# EAGLE design IRQF103C8revC (EAGLE 9.0.0)
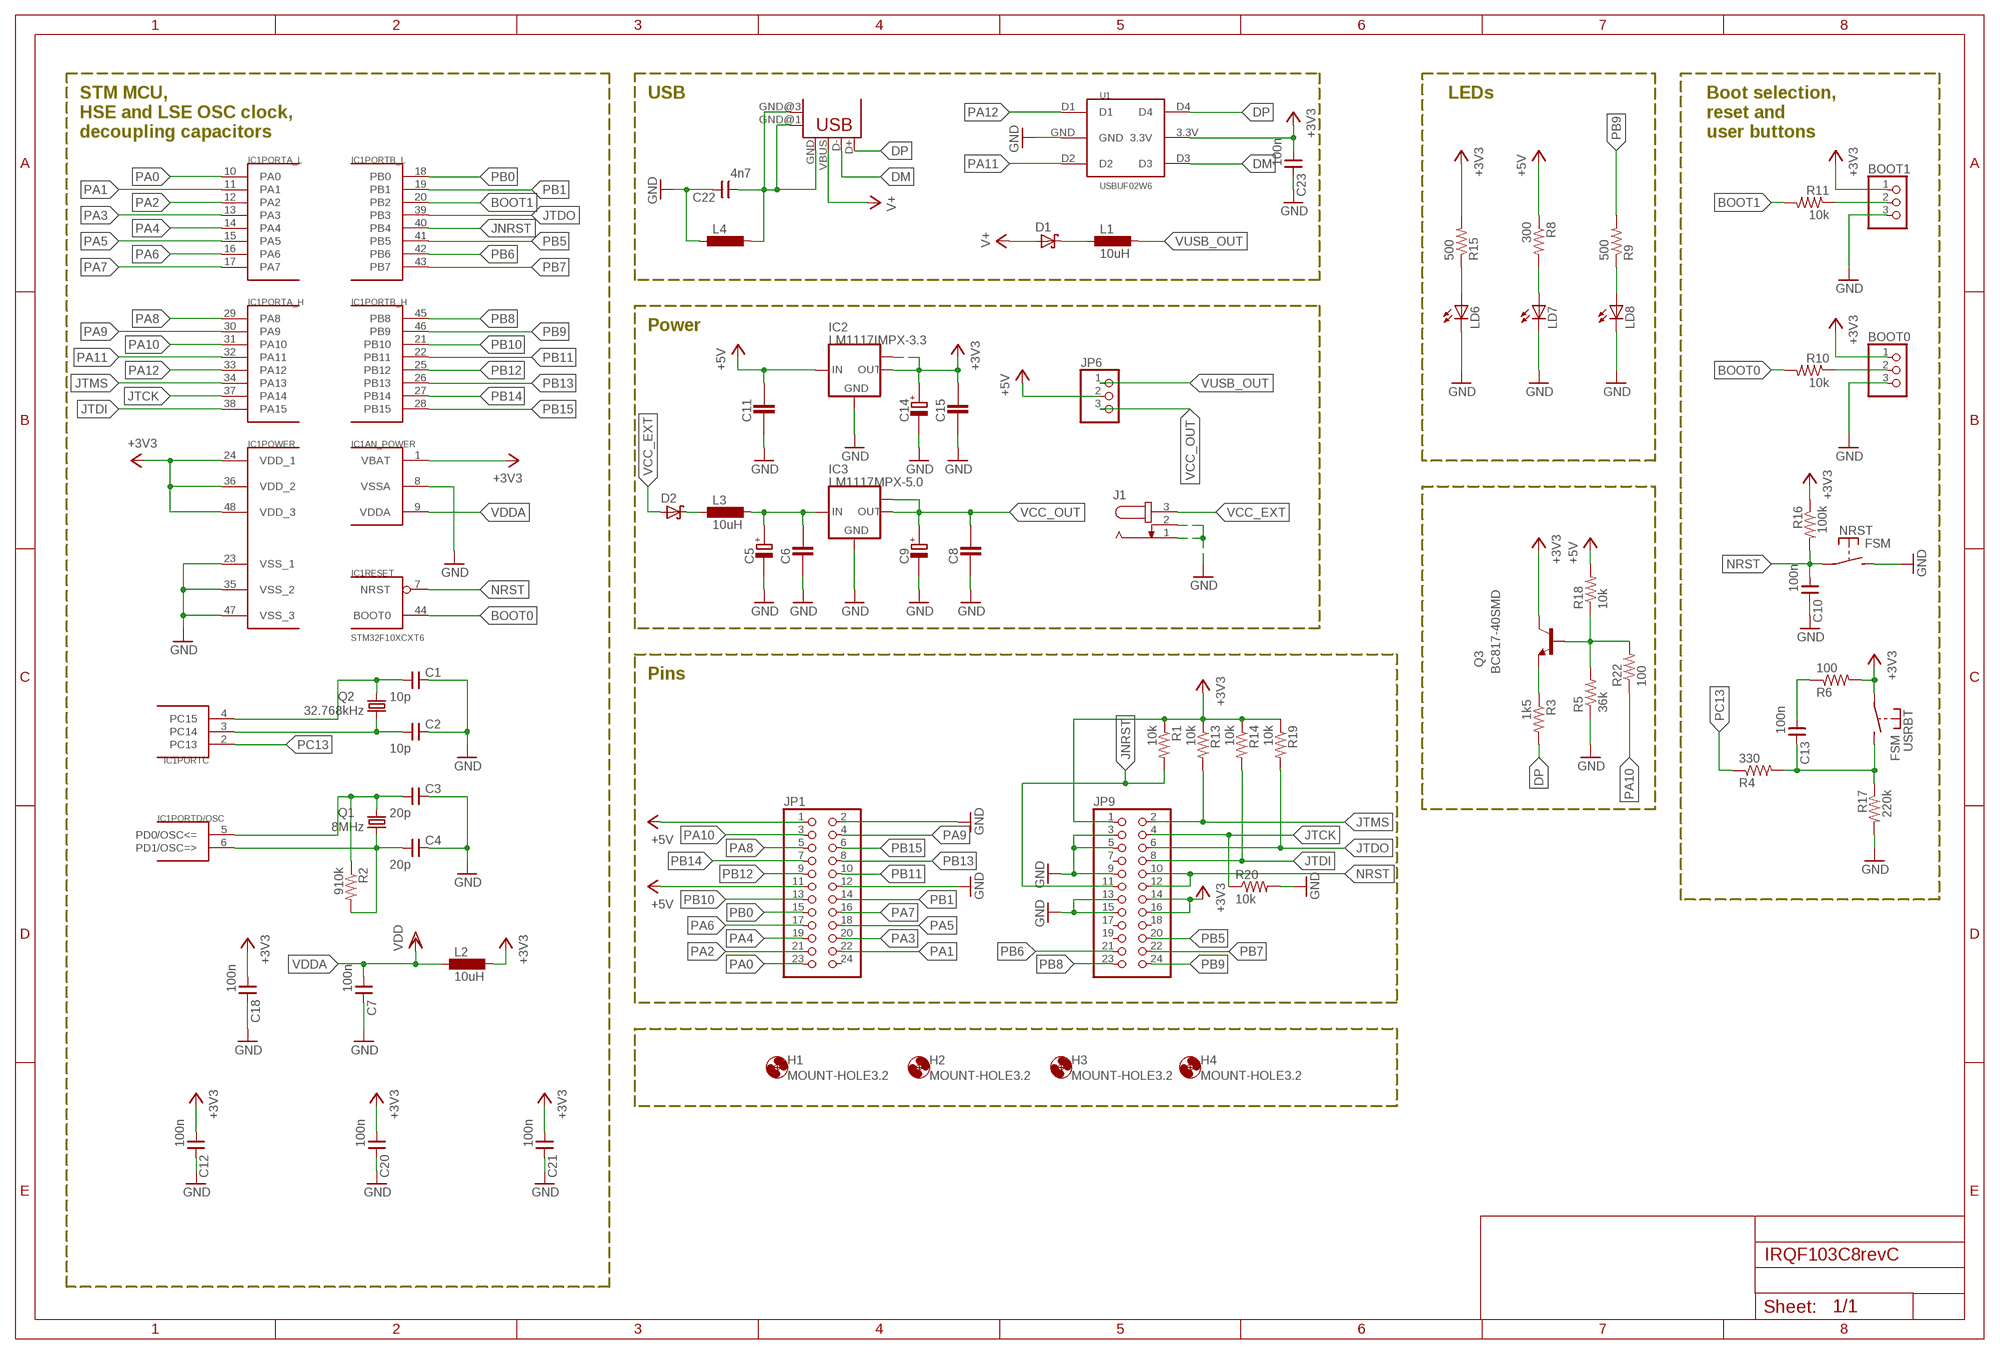
[diagram p0: schematic, sheet 1]

## Parts
BOOT0  PINHD-1X3  [1X03]
BOOT1  PINHD-1X3  [1X03]
C1  10p  CNP-0805  [0805]
C2  10p  CNP-0805  [0805]
C3  20p  CNP-0805  [0805]
C4  20p  CNP-0805  [0805]
C5  POLARISED_CASE_B  [CAPAE430X540N]
C6  CAPACITOR_0805  [CAPC2012X145AN]
C7  100n  CNP-0805  [0805]
C8  CAPACITOR_0805  [CAPC2012X145AN]
C9  POLARISED_CASE_D  [CAPAE660X540N]
C10  100n  CNP-0805  [0805]
C11  CAPACITOR_1206  [CAPC3215X168N]
C12  100n  CNP-0805  [0805]
C13  100n  CNP-0805  [0805]
C14  POLARISED_CASE_C  [CAPAE530X540N]
C15  CAPACITOR_0805  [CAPC2012X145AN]
C18  100n  CNP-0805  [0805]
C20  100n  CNP-0805  [0805]
C21  100n  CNP-0805  [0805]
C22  4n7  CNP-0805  [0805]
C23  100n  CNP-0805  [0805]
D1  SCHOTTKY_SMA  [DIOM5326X292N]
D2  SCHOTTKY_SMA  [DIOM5326X292N]
H1  MOUNT-HOLE3.2  [3,2]
H2  MOUNT-HOLE3.2  [3,2]
H3  MOUNT-HOLE3.2  [3,2]
H4  MOUNT-HOLE3.2  [3,2]
IC1  STM32F10XCXT6  [TQFP48]
IC2  LM1117IMPX-3.3  [SOT223]
IC3  LM1117MPX-5.0  [SOT223]
J1  JACK-PLUG1  [SPC4078]
JP1  PINHD-2X12  [2X12]
JP6  PINHD-1X3  [1X03]
JP9  PINHD-2X12  [2X12]
L1  10uH  INDUCTOR_0603  [INDC1608X95N]
L2  10uH  INDUCTOR_0603  [INDC1608X95N]
L3  10uH  INDUCTOR_0603  [INDC1608X95N]
L4  INDUCTOR_0603  [INDC1608X95N]
LD6  LEDCHIPLED_0805  [CHIPLED_0805]
LD7  LEDCHIPLED_0805  [CHIPLED_0805]
LD8  LEDCHIPLED_0805  [CHIPLED_0805]
NRST  FSM  [FSM]
Q1  8MHz  CRYTALHC49S  [HC49/S]
Q2  32.768kHz  CRYTALTC26H  [TC26H]
Q3  BC817-40SMD  [SOT23-BEC]
R1  10k  R-US_M0805  [M0805]
R2  910k  R-US_M0805  [M0805]
R3  1k5  R-US_M0805  [M0805]
R4  330  R-US_M0805  [M0805]
R5  36k  R-US_M0805  [M0805]
R6  100  R-US_M0805  [M0805]
R8  300  R-US_M0805  [M0805]
R9  500  R-US_M0805  [M0805]
R10  10k  R-US_M0805  [M0805]
R11  10k  R-US_M0805  [M0805]
R13  10k  R-US_M0805  [M0805]
R14  10k  R-US_M0805  [M0805]
R15  500  R-US_M0805  [M0805]
R16  100k  R-US_M0805  [M0805]
R17  220k  R-US_M0805  [M0805]
R18  10k  R-US_M0805  [M0805]
R19  10k  R-US_M0805  [M0805]
R20  10k  R-US_M0805  [M0805]
R22  100  R-US_M0805  [M0805]
U1  USBUF02W6  [SOT23-6L]
USB1  USB-MB-S  [USB-MB-S]
USRBT  FSM  [FSM]

## Nets
+3V3: BOOT0.1 BOOT1.1 C12.1 C14.+ C15.2 C18.1 C20.1 C21.1 C23.1 IC1.1(AN_POWER:VBAT) IC1.24(POWER:VDD_1) IC1.36(POWER:VDD_2) IC1.48(POWER:VDD_3) IC2.2(OUT) IC2.TAB(OUT1) JP9.1 JP9.14 JP9.16 L2.2 Q3.C R1.1 R6.2 R13.1 R14.1 R15.2 R16.1 R19.1 U1.3.3V USRBT.P$1(P)
+5V: C11.2 IC2.3(IN) JP1.1 JP1.11 JP6.2 R8.1 R18.2
BOOT0: IC1.44(RESET:BOOT0) R10.2
BOOT1: IC1.20(PORTB_L:PB2) R11.2
DM: U1.D3 USB1.D-
DP: R3.2 U1.D4 USB1.D+
GND: BOOT0.3 BOOT1.3 C1.2 C2.2 C3.2 C4.2 C5.- C6.1 C7.2 C8.1 C9.- C10.2 C11.1 C12.2 C14.- C15.1 C18.2 C20.2 C21.2 C22.2 C23.2 IC1.8(AN_POWER:VSSA) IC1.23(POWER:VSS_1) IC1.35(POWER:VSS_2) IC1.47(POWER:VSS_3) IC2.1(GND) IC3.1(GND) J1.1 J1.2 JP1.2 JP1.12 JP9.3 JP9.5 JP9.9 JP9.13 JP9.15 L4.1 LD6.C LD7.C LD8.C NRST.P$2(S) R5.1 R17.2 R20.2 U1.GND
JNRST: IC1.40(PORTB_L:PB4) JP9.11 R1.2
JTCK: IC1.37(PORTA_H:PA14) JP9.4 R20.1
JTDI: IC1.38(PORTA_H:PA15) JP9.8 R14.2
JTDO: IC1.39(PORTB_L:PB3) JP9.6 R19.2
JTMS: IC1.34(PORTA_H:PA13) JP9.2 R13.2
N$1: C2.1 IC1.3(PORTC:PC14) Q2.1
N$2: C1.1 IC1.4(PORTC:PC15) Q2.2
N$3: C4.1 IC1.6(PORTD/OSC:PD1/OSC=>) Q1.1 R2.2
N$4: C3.1 IC1.5(PORTD/OSC:PD0/OSC<=) Q1.2 R2.1
N$5: BOOT0.2 R10.1
N$6: LD7.A R8.2
N$7: D2.K L3.1
N$8: D1.K L1.1
N$9: Q3.B R5.2 R18.1 R22.2
N$10: C5.+ C6.2 IC3.3(IN) L3.2
N$11: Q3.E R3.1
N$12: C13.2 R4.2 R17.1 USRBT.P$2(S)
N$13: C13.1 R6.1
N$15: LD8.A R9.1
N$16: C22.1 L4.2 USB1.GND USB1.GND@1(GND) USB1.GND@3(GND)
N$19: LD6.A R15.1
NRST: C10.1 IC1.7(RESET:NRST) JP9.10 JP9.12 NRST.P$1(P) R16.2
PA0: IC1.10(PORTA_L:PA0) JP1.23
PA1: IC1.11(PORTA_L:PA1) JP1.22
PA2: IC1.12(PORTA_L:PA2) JP1.21
PA3: IC1.13(PORTA_L:PA3) JP1.20
PA4: IC1.14(PORTA_L:PA4) JP1.19
PA5: IC1.15(PORTA_L:PA5) JP1.18
PA6: IC1.16(PORTA_L:PA6) JP1.17
PA7: IC1.17(PORTA_L:PA7) JP1.16
PA8: IC1.29(PORTA_H:PA8) JP1.5
PA9: IC1.30(PORTA_H:PA9) JP1.4
PA10: IC1.31(PORTA_H:PA10) JP1.3 R22.1
PA11: IC1.32(PORTA_H:PA11) U1.D2
PA12: IC1.33(PORTA_H:PA12) U1.D1
PB0: IC1.18(PORTB_L:PB0) JP1.15
PB1: IC1.19(PORTB_L:PB1) JP1.14
PB2: BOOT1.2 R11.1
PB5: IC1.41(PORTB_L:PB5) JP9.20
PB6: IC1.42(PORTB_L:PB6) JP9.21
PB7: IC1.43(PORTB_L:PB7) JP9.22
PB8: IC1.45(PORTB_H:PB8) JP9.23
PB9: IC1.46(PORTB_H:PB9) JP9.24 R9.2
PB10: IC1.21(PORTB_H:PB10) JP1.13
PB11: IC1.22(PORTB_H:PB11) JP1.10
PB12: IC1.25(PORTB_H:PB12) JP1.9
PB13: IC1.26(PORTB_H:PB13) JP1.8
PB14: IC1.27(PORTB_H:PB14) JP1.7
PB15: IC1.28(PORTB_H:PB15) JP1.6
PC13: IC1.2(PORTC:PC13) R4.1
V+: D1.A USB1.VBUS
VCC_EXT: D2.A J1.3
VCC_OUT: C8.2 C9.+ IC3.2(OUT) IC3.TAB(OUT1) JP6.3
VDDA: C7.1 IC1.9(AN_POWER:VDDA) L2.1 ; supply symbol labelled VDD
VUSB_OUT: JP6.1 L1.2
Unconnected: JP1.24 JP9.7 JP9.17 JP9.18 JP9.19

## Notes on the sheet
- USB | LEDs
- STM MCU, 
  HSE and LSE OSC clock,
  decoupling capacitors
- Boot selection,
  reset and
  user buttons
- Power
- Pins

## Library data of the parts
BOOT0 BOOT1 JP6 = pinhead:PINHD-1X3: PIN HEADER
C1-C4 C7 C10 C12 C13 C18 C20-C23 = cap-master:CNP-: NON-POLARIZED CAP
C5 C9 C14 = ipc-7351-capacitor:POLARISED_
C6 C8 C11 C15 = ipc-7351-capacitor:CAPACITOR_
D1 D2 = ipc-7351-diode:SCHOTTKY_
H1-H4 = holes:MOUNT-HOLE: MOUNTING HOLE with drill center marker
IC1 = stm32:STM32F10XCXT6: ST STM32F101/103 48pin LQFP
IC2 = lm1117:LM1117IMPX-*
IC3 = lm1117:LM1117MPX-*
J1 = con-jack:JACK-PLUG: DC POWER JACK Power Jack, DC, Right Angle, Through Hole, Rated 5A at 16VDC, PC Terminals Distributor: Farnell (www.Farnell.de) Drawing: 84N1161.pdf / 84N1162.pdf Manufacturer: SPC Technology (www.spctechnology.com) Type: SPC4077 / SPC 4078
JP1 JP9 = pinhead:PINHD-2X12: PIN HEADER
L1-L4 = ipc-7351-inductor:INDUCTOR_
LD6-LD8 = led:LED: LED OSRAM: - CHIPLED LG R971, LG N971, LY N971, LG Q971, LY Q971, LO R971, LY R971 LH N974, LH R974 LS Q976, LO Q976, LY Q976 LO Q996 - Hyper CHIPLED LW Q18S LB Q993, LB Q99A, LB R99A - SideLED LS A670, LO A670, LY A670, LG A670, LP A670 LB A673, LV A673, LT A673, LW A673 LH A674 LY A675 LS A676, LA A676, LO A676, LY A676, LW A676 LS A679, LY A679, LG A679 - Hyper Micro SIDELED® LS Y876, LA Y876, LO Y876, LY Y876 LT Y87S - SmartLED LW L88C, LW L88S LB L89C, LB L89S, LG L890 LS L89K, LO L89K, LY L89K LS L896, LA L896, LO L896, LY L896 - TOPLED LS T670, LO T670, LY T670, LG T670, LP T670 LSG T670, LSP T670, LSY T670, LOP T670, LYG T670 LG T671, LOG T671, LSG T671 LB T673, LV T673, LT T673, LW T673 LH T674 LS T676, LA T676, LO T676, LY T676, LB T676, LH T676, LSB T676, LW T676 LB T67C, LV T67C, LT T67C, LS T67K, LO T67K, LY T67K, LW E67C LS E67B, LA E67B, LO E67B, LY E67B, LB E67C, LV E67C, LT E67C LW T67C LS T679, LY T679, LG T679 LS T770, LO T770, LY T770, LG T770, LP T770 LB T773, LV T773, LT T773, LW T773 LH T774 LS E675, LA E675, LY E675, LS T675 LS T776, LA T776, LO T776, LY T776, LB T776 LHGB T686 LT T68C, LB T68C - Hyper Mini TOPLED® LB M676 - Mini TOPLED Santana® LG M470 LS M47K, LO M47K, LY M47K Source: http://www.osram.convergy.de/
NRST USRBT = switch-misc:FSM: TYCO SWITCH
Q1 Q2 = crystal:CRYTAL: CRYSTAL
Q3 = transistor-npn:BC817*: NPN Transistor
R1-R6 R8-R11 R13-R20 R22 = resistor:R-US_: RESISTOR, American symbol
U1 = USBUF:USBUF02W6: EMI filter and line termination for USB upstream ports
USB1 = con-usb-2:USB: USB Connectors

## Board
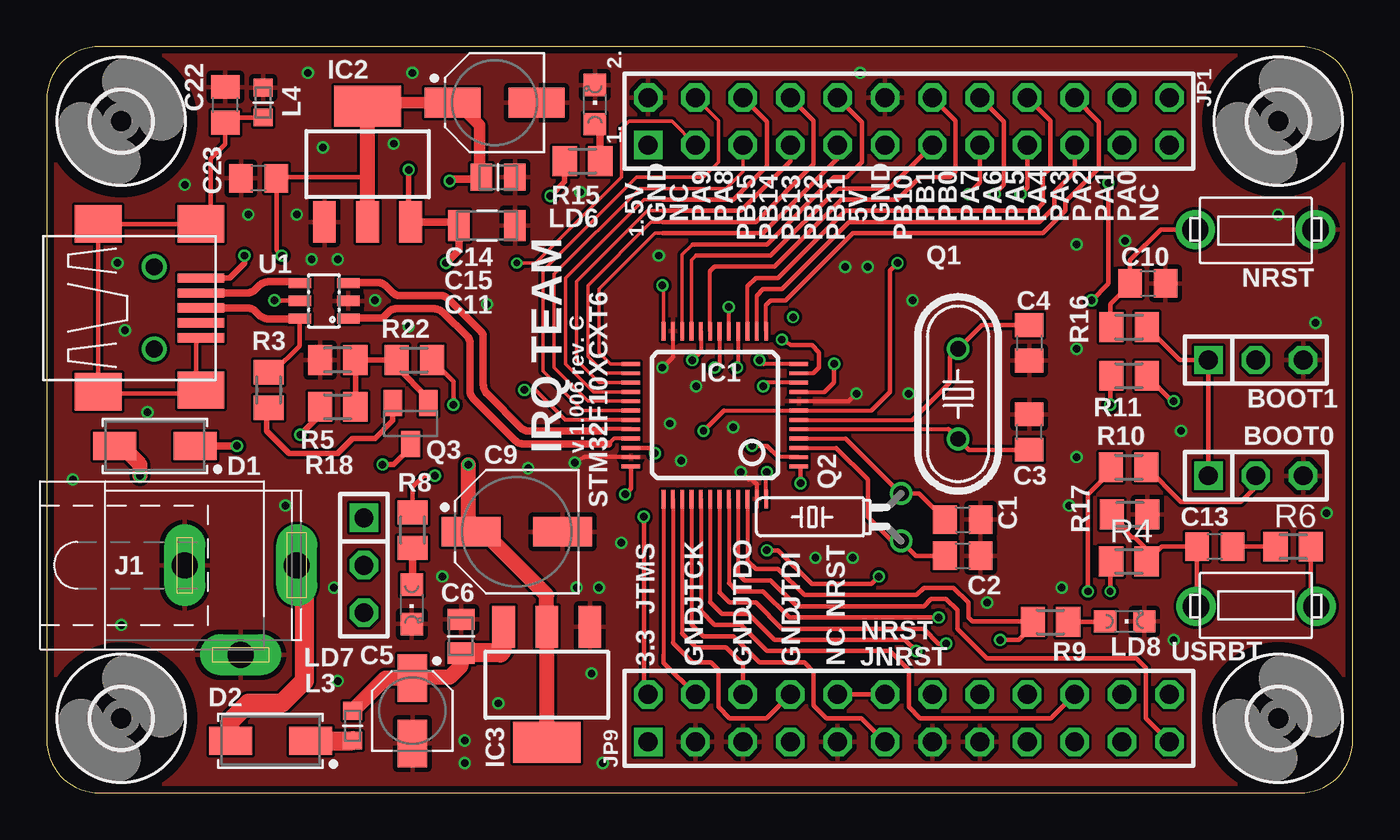
[diagram p1: board, top side]
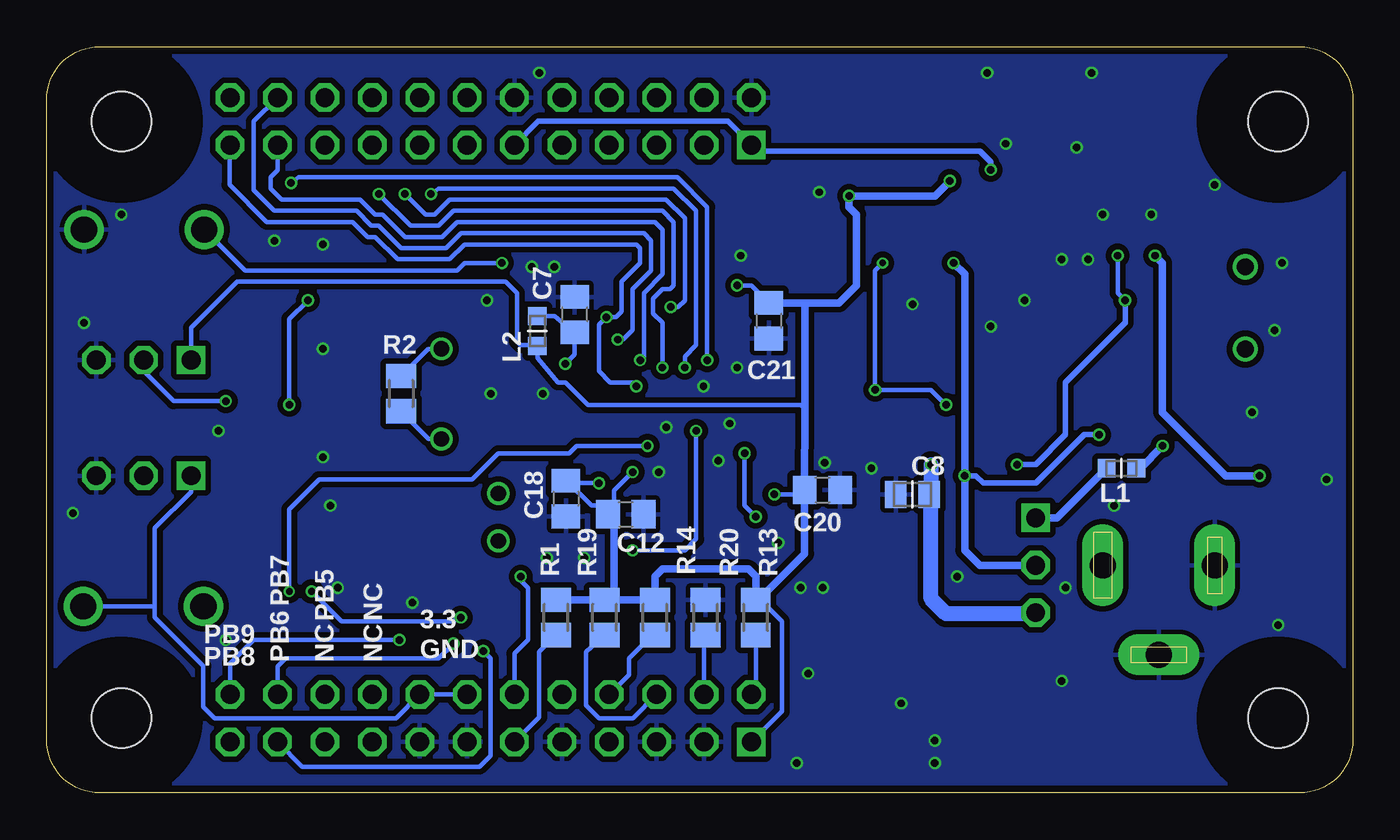
[diagram p2: board, bottom side, seen from below]

Size 70 x 40 mm. Coordinates in mm from the lower left corner, seen from the top.
Outline: 0,37.17 0,2.83 arc90 2.83,0 67.17,0 arc90 70,2.83 70,37.17 arc90 67.17,40 2.83,40 arc90 0,37.17
Copper layers (1*16): Top 0.035559375mm / dielectric 1.6mm / Bottom 0.035559375mm
Design rules "oshpark-2layer": minimum track width 6mil, minimum drill 10mil, track to track 6mil, track to pad 6mil, pad to pad 6mil, via to via 6mil, smd to smd 6mil, copper to edge 15mil, drill to drill 6mil, minimum pad ring 5mil, minimum via ring 5mil, stop-mask expansion 2.5mil, vias tented up to drill 0mil, thermal gap 10mil

### Footprints (pad centres in the part's own frame; a part is rotated, then mirrored left to right if it is on the bottom)
1X03 = drill 1.016 square: 1 -2.54,0 | drill 1.016 octagon: 2 0,0; 3 2.54,0
0805 = smd 1.27 x 1.524: 1 -0.953,0; 2 0.953,0
CAPAE430X540N = smd 2.55 x 1.6: + -1.75,0; - 1.75,0
CAPC2012X145AN = smd 1.15 x 1.45: 1 -0.9,0; 2 0.9,0
CAPAE660X540N = smd 3.15 x 1.6: + -2.45,0; - 2.45,0
CAPC3215X168N = smd 1.15 x 1.65: 1 -1.5,0; 2 1.5,0
CAPAE530X540N = smd 3 x 1.6: + -2.25,0; - 2.25,0
DIOM5326X292N = smd 2.3 x 1.5: A 2.15,0; K -2.15,0
3,2 = hole 3.2: 0,0
TQFP48 = smd 0.2 x 1: 1 -2.75,-4.5; 2 -2.25,-4.5; 3 -1.75,-4.5; 4 -1.25,-4.5; 5 -0.75,-4.5; 6 -0.25,-4.5; 7 0.25,-4.5; 8 0.75,-4.5; 9 1.25,-4.5; 10 1.75,-4.5; 11 2.25,-4.5; 12 2.75,-4.5; 25 2.75,4.5; 26 2.25,4.5; 27 1.75,4.5; 28 1.25,4.5; 29 0.75,4.5; 30 0.25,4.5; 31 -0.25,4.5; 32 -0.75,4.5; 33 -1.25,4.5; 34 -1.75,4.5; 35 -2.25,4.5; 36 -2.75,4.5 | smd 1 x 0.2: 13 4.5,-2.75; 14 4.5,-2.25; 15 4.5,-1.75; 16 4.5,-1.25; 17 4.5,-0.75; 18 4.5,-0.25; 19 4.5,0.25; 20 4.5,0.75; 21 4.5,1.25; 22 4.5,1.75; 23 4.5,2.25; 24 4.5,2.75; 37 -4.5,2.75; 38 -4.5,2.25; 39 -4.5,1.75; 40 -4.5,1.25; 41 -4.5,0.75; 42 -4.5,0.25; 43 -4.5,-0.25; 44 -4.5,-0.75; 45 -4.5,-1.25; 46 -4.5,-1.75; 47 -4.5,-2.25; 48 -4.5,-2.75
SOT223 = smd 1.219 x 2.235: 1 -2.311,-3.099; 2 0,-3.099; 3 2.311,-3.099 | smd 3.6 x 2.2: TAB 0,3.099
SPC4078 = drill 1.4 pad 2.184 long: 1 -3,0; 2 0,-4.8; 3 3,0
2X12 = drill 1.016 square: 1 -13.97,-1.27 | drill 1.016 octagon: 2 -13.97,1.27; 3 -11.43,-1.27; 4 -11.43,1.27; 5 -8.89,-1.27; 6 -8.89,1.27; 7 -6.35,-1.27; 8 -6.35,1.27; 9 -3.81,-1.27; 10 -3.81,1.27; 11 -1.27,-1.27; 12 -1.27,1.27; 13 1.27,-1.27; 14 1.27,1.27; 15 3.81,-1.27; 16 3.81,1.27; 17 6.35,-1.27; 18 6.35,1.27; 19 8.89,-1.27; 20 8.89,1.27; 21 11.43,-1.27; 22 11.43,1.27; 23 13.97,-1.27; 24 13.97,1.27
INDC1608X95N = smd 0.95 x 1: 1 -0.8,0; 2 0.8,0
CHIPLED_0805 = smd 1.2 x 1.2: A 0,-1.05; C 0,1.05
FSM = drill 1.397: P$1 0,3.25; P$2 0,-3.2
HC49/S = drill 0.813: 1 -2.413,0; 2 2.413,0
TC26H = drill 0.813: 1 -1.27,0; 2 1.27,0
SOT23-BEC = smd 1 x 1.4: B -0.95,-1.1; C 0,1.1; E 0.95,-1.1
M0805 = smd 1.3 x 1.6: 1 -0.95,0; 2 0.95,0
SOT23-6L = smd 0.55 x 1.2: 3.3V 0,1.3; D1 -0.95,-1.3; D2 0.95,-1.3; D3 0.95,1.3; D4 -0.95,1.3; GND 0,-1.3
USB-MB-S = smd 2.5 x 0.5: D+ 2.5,0; D- 2.5,0.8; GND 2.5,-1.6; ID 2.5,-0.8; VBUS 2.5,1.6 | smd 2.5 x 2: GND@1 -3,4.5; GND@2 2.5,4.5; GND@3 -3,-4.5; GND@4 2.5,-4.4 | drill 0.9: P$5 0,2.2; P$6 0,-2.2

### Placement (x,y rotation side)
BOOT0  64.8,17 0 top
BOOT1  64.8,23.2 0 top
C1  49.1,14.65 0 top
C2  49.1,12.71 0 top
C3  52.66,19.34 90 top
C4  52.66,24.13 270 top
C5  19.6,4.4 270 top
C6  22.2,8.4 270 top
C7  41.7,25.63 90 bottom
C8  23.6,16 0 bottom
C9  25.2,14 0 top
C10  59.01,27.31 0 top
C11  23.6,30.4 180 top
C12  38.97,14.93 0 bottom
C13  62.6,13.2 180 top
C14  24,37 0 top
C15  24.2,33 180 top
C18  42.17,15.77 270 bottom
C20  28.43,16.24 0 bottom
C21  31.29,25.31 270 bottom
C22  9.57,36.88 90 top
C23  11.37,32.94 180 top
D1  5.8,18.6 180 top
D2  12,2.8 180 top
H1  66,36 0 top
H2  4,36 0 top
H3  4,4 0 top
H4  66,4 0 top
IC1  35.81,20.24 90 top
IC2  17.2,33.7 0 top
IC3  26.8,5.8 180 top
J1  10.4,12.2 0 top
JP1  46.2,36 0 top
JP6  17,12.2 270 top
JP9  46.2,4 0 top
L1  12.4,17.4 180 bottom
L2  43.7,24.75 270 bottom
L3  16.4,3.6 90 top
L4  11.6,37 270 top
LD6  29.38,36.9 0 top
LD7  19.56,10.1 180 top
LD8  57.77,9.19 270 top
NRST  64.8,30.2 90 top
Q1  48.85,21.39 270 top
Q2  45.79,14.78 90 top
Q3  19.5,19.8 180 top
R1  42.7,9.4 270 bottom
R2  51,21.4 90 bottom
R3  11.9,21.6 90 top
R4  58,12.4 0 top
R5  15.6,23.2 0 top
R6  66.8,13.2 0 top
R8  19.61,14.08 270 top
R9  53.8,9.16 180 top
R10  57.99,17.46 180 top
R11  58,22.36 180 top
R13  32,9.4 270 bottom
R14  37.4,9.4 270 bottom
R15  28.72,33.86 180 top
R16  58.01,24.97 180 top
R17  58.04,14.92 0 top
R18  15.6,20.7 180 top
R19  40.1,9.4 270 bottom
R20  34.7,9.4 90 bottom
R22  19.7,23.2 180 top
U1  14.86,26.37 90 top
USB1  5.76,25.99 0 top
USRBT  64.8,10 270 top

### Tracks (layer width: path | path; a pad name or v marks a point on that pad's centre or on a via)
+3V3  (via drill 0.4, 0.4 pad 0.25)
  Top 0.2: IC1.24 33.06,27.14
  Top 0.203: IC1.48 38.56,17.16 | IC1.1 40.4,17.49
  Top 0.254: U1.3.3V 13.53,26.4 v12.2,26.4 | v12.6,28.8 12.32,29.08 C23.1 12.37,33 17.2,33 | 33.06,27.14 v33,27.2 | R16.1 60.72,23.2 BOOT1.1 BOOT0.1 | IC1.36 31.31,16.31 v31,16 | 38.56,17.16 v38.6,17.2 | 40.4,17.49 v40.4,16.6 | R6.2 67.75,10.3 USRBT.P$1
  Top 0.305: v18,17.6 18.6,17.6 19.5,18.5 Q3.C | R15.2 27.77,32.77 v27,32
  Top 0.406: 23.2,32.9 21.7,32.9 v21.6,32.8
  Top 0.61: 17.6,36.6 18,37 C14.+ 22,37 23.2,35.8 23.2,33.1 C15.2 23.2,32.9
  Top 0.813: 17.2,36.2 17.2,33 IC2.2 | 17.2,36.2 IC2.TAB | 17.2,36.2 17.6,36.6
  Bottom 0.254: v12.2,26.4 12.6,26.8 v12.6,28.8 | v33,27.2 32.23,27.2 C21.1 | R13.1 31.65,10 31.4,10 30.6,9.2 30.6,4.36 JP9.1 | v31,16 29.54,16 C20.1 | v38.6,17.2 39.6,16.2 39.6,15.4 | 39.6,14.61 39.6,15.4 | 39.6,15.4 39.8,15.6 arc28 40.6,15.4 40.8,15.4 42.13,16.73 C18.1 42.17,16.6 v40.4,16.6 | 29.37,21.6 | 29.37,20.6 29.57,20.8 41,20.8 42.2,22 42.6,22 43.7,23.3 L2.2 43.95,24 44.6,24 44.8,24.2 44.8,26.8 45.4,27.4 59.8,27.4 62.26,24.94 BOOT1.1 | JP9.14 JP9.16 51.28,4 61,4 61.6,4.6 61.6,6.8 64.2,9.4 64.2,10 | 64.2,10 64.2,14.2 62.26,16.14 BOOT0.1 | USRBT.P$1 64.2,10
  Bottom 0.305: v12.2,26.4 12.2,25.2 15.4,22 15.4,19.2 17,17.6 v18,17.6
  Bottom 0.406: 29.4,26.26 C21.1 | 29.4,26.26 29.36,26.22 29.37,21.6 29.37,20.6 C20.1 29.38,12.82 31.85,10.35 R13.1 32,11.6 32.4,12 37,12 37.4,11.6 R14.1 39.6,10.35 | 39.6,10.35 R19.1 R1.1 | C12.1 39.6,14.61 39.6,10.35 | 29.4,26.26 27.54,26.26 26.6,27.2 26.6,31 27,31.4 v27,32 22.4,32 v21.6,32.8
+5V  (via drill 0.4)
  Top 0.254: R8.1 19.61,16.41 20.2,17 v20.8,17
  Top 0.305: v19.4,33.4 19.4,31.2 19.51,31.09 IC2.3 | 14.65,20.65 R18.2 14.65,20.25 v13.6,19.2
  Top 0.406: v21.4,28.4 22.1,29.1 C11.2 21.9,30.6 IC2.3
  Bottom 0.305: v19.4,33.4 19.4,33.8 20,34.4 31.9,34.4 JP1.1 33.5,36 43.66,36 JP1.11 | v13.6,19.2 14.4,19.2 17,16.6 19.8,16.6 20.2,17 v20.8,17
  Bottom 0.406: v21.4,28.4 20.8,27.8 v20.8,17 20.8,13 20,12.2 JP6.2
BOOT0  (via drill 0.4, 0.4 pad 0.25)
  Top 0.203: IC1.44 36.56,11.24
  Top 0.254: 36.56,11.24 37,10.8 38.4,10.8 39.8,9.4 v47.8,9.4 | R10.2 57.04,17.24 55.8,16 v55.8,10.8
  Bottom 0.254: v47.8,9.4 48,9.4 48.2,9.2 54.2,9.2 v55.8,10.8
BOOT1  (via drill 0.4)
  Top 0.203: IC1.20 35.06,23.66
  Top 0.254: 35.06,23.66 v34.6,23.2 | v56.9,32.7 56.9,27.3 v56,26.4 | v57,20.8 57,22.3 R11.2
  Bottom 0.254: v34.6,23.2 34.6,31.4 36.2,33 56.5,33 v56.9,32.7 | v56,26.4 57,25.4 v57,20.8
DM
  Top 0.254: 13.48,27.4 U1.D3 | 11.18,26.98 11.25,27.05
  Top 0.406: USB1.D- 10.73,26.79 arc45 11.18,26.98 11.36,27.16 arc-45 11.94,27.4 13.48,27.4
DP
  Top 0.254: R3.2 12.15,22.55 13.56,23.96 U1.D4 13.54,25.4
  Top 0.406: USB1.D+ 10.75,25.99 arc-45 11.19,25.81 11.39,25.61 arc45 11.9,25.4 13.54,25.4
GND  (via drill 0.4)
  Top 0.2: IC1.23 33.56,23.36
  Top 0.203: IC1.47 38.06,16.54 | IC1.8 42.99,20.99 | IC1.35 28.8,17.99 v28.3,17.7
  Top 0.254: 38.06,16.54 37.8,16.8 37.6,16.8 v37.2,17.2 | 42.99,20.99 v43.4,21.4 | 33.56,23.36 v33,22.8
  Bottom 0.254: C12.2 38.02,14.44 38.06,14.4
  other vias: 30.8,13.4 22.4,1.6 15.6,6 22.4,2.8 15.4,11 12.8,15.4 4.2,24.8 10.8,31 14,38.6 14.8,34.6 18.6,34.8 13.4,31 17.6,26.4 28.6,32.2 14.2,28.6 19.6,38.6 15.6,28.6 43.6,38.6 32.8,28.8 57.8,29.6 66,31 68,25.2 4,9 5.4,20.4 1.4,16.8 3.8,28.4 7.4,32.6 29.8,1.6 46.2,21.4 33.4,19.8 60.4,8.2 68.6,15 60.8,19.4 24.2,4.8 29.2,6.4 23.6,26.2 19.4,25 34.8,21.8 46.4,26.4 55.2,29.4 42.8,28.2 34,17.8 36.8,19.6 41.2,12.6 43.2,12.6 55.2,23.8 55.2,18 54.8,15.4 50.4,10.2 54.4,11 44,28.2 25.8,17.4 28.4,11 29.6,11 21.2,11.6
  pour Top: -0.8,40.6 70.4,40.6 70.6,-0.8 -0.8,-0.8
  pour Bottom (isolate 0.305): -0.8,40.6 70.4,40.6 70.6,-0.8 -0.8,-0.8
JNRST
  Top 0.203: IC1.40 34.56,9.04
  Top 0.254: 34.56,9.04 35.2,8.4 36.8,8.4 38.2,7 40.6,7 41.1,6.5 41.1,4.7 41.8,4 43.66,4 JP9.11
  Bottom 0.254: 42.82,8.45 R1.2 43.6,7.55 43.6,4.06 JP9.11
JTCK
  Top 0.203: IC1.37 33.06,7.37
  Top 0.254: 33.06,7.37 33.07,7.37 33.07,6.97 JP9.4
  Bottom 0.254: JP9.4 34.77,8.38 R20.1
JTDI
  Top 0.203: IC1.38 33.56,8.04
  Top 0.254: 33.56,8.04 34.6,7 35.6,7 36,6.6 36,4.6 36.6,4 38.58,4 JP9.8
  Bottom 0.254: R14.2 37.55,8.45 38.8,7.2 38.8,6.32 JP9.8
JTDO
  Top 0.203: IC1.39 34.06,8.54
  Top 0.254: 34.06,8.54 34.8,7.8 36.4,7.8 37.31,6.89 JP9.6
  Bottom 0.254: R19.2 41.1,7.55 41.1,4.7 40.4,4 38.58,4 JP9.6 37.31,5.31 37.3,5.3
JTMS  (via drill 0.4 pad 0.25)
  Top 0.254: IC1.34 32.31,18.49 v32.6,18.2 | v32,14.8 32,5.5 JP9.2
  Bottom 0.254: v32.6,18.2 32.6,15.4 v32,14.8 | JP9.2 32,5.5 R13.2
N$1
  Top 0.203: IC1.3 42.31,18.49
  Top 0.254: 42.31,18.49 44,16.8 44,14.8 45.29,13.51 Q2.1 46.59,12.71 C2.1
N$2
  Top 0.203: IC1.4 42.81,18.99
  Top 0.254: 42.81,18.99 45.75,16.05 Q2.2 46.74,16.05 C1.1
N$3
  Top 0.203: IC1.6 46.39,19.99
  Top 0.254: 46.39,19.99 48.4,22 48.4,23.36 Q1.1 50.13,25.08 C4.1
  Bottom 0.254: Q1.1 49.55,23.8 R2.2
N$4
  Top 0.203: IC1.5 48.33,19.49
  Top 0.254: 48.33,19.49 Q1.2 49.43,18.39 C3.1
  Bottom 0.254: Q1.2 49.52,18.98 R2.1
N$5
  Top 0.254: R10.1 60.79,15.6 64,15.6 64.8,16.4 BOOT0.2
N$6
  Top 0.406: R8.2 19.61,11.2 LD7.A
N$7
  Top 1.016: D2.K L3.1
N$8  (via drill 0.4)
  Top 0.406: D1.K v10.2,18.6
  Bottom 0.406: v10.2,18.6 11.4,17.4 L1.1
N$9
  Top 0.305: R18.1 R5.2 R22.2 18.75,22.85 20.45,21.15 Q3.B
N$10
  Top 0.813: L3.2 18.15,6.15 C5.+ 19.65,6.2 21.6,6.2 22.2,6.8 C6.2
  Top 1.016: IC3.3 24.4,8.81 24.4,7.6 24.3,7.5 C6.2
N$11
  Top 0.305: R3.1 11.8,20.55 11.8,19.4 13,18.2 15.6,18.2 16.4,19 17.6,19 18.55,19.95 Q3.E
N$12
  Top 0.254: USRBT.P$2 61.65,10.05 C13.2 59.75,13.2 59.08,12.53 | 59.08,12.53 R4.2 | 59.08,12.53 59.08,12.94 58.32,13.7 58.16,13.7 57.91,13.95 57.91,14.1 R17.1
N$13
  Top 0.254: C13.1 R6.1
N$15
  Top 0.254: R9.1 56.69,9.16 LD8.A
N$16
  Top 0.254: USB1.GND 8,24.13 8,21.4 2.76,21.4 USB1.GND@3 USB1.GND@1 8.29,30.49 8.8,31 8.8,34 9.57,34.77 C22.1 | C22.1 | L4.2 9.57,36.2 C22.1
N$19
  Top 0.406: R15.1 29.67,35.56 LD6.A
NRST  (via drill 0.4)
  Top 0.203: 44.19,20.49 IC1.7 36.29,20.49
  Top 0.254: R16.2 57,25.02 57,26.2 58.06,27.26 C10.1 58.06,28.55 59.7,30.2 NRST.P$1 | v38.6,13 39.2,13 41,11.2 44.2,11.2 v44.6,11.6 | JP9.12 JP9.10 | 44.19,20.49 45.2,21.5 45.2,28 v45.6,28.4 | v35.2,19.4 36.29,20.49
  Bottom 0.254: v38.6,13 35.8,13 35.2,13.6 v35.2,19.4 | v44.6,11.6 44.6,11.4 44.2,11 44.2,8.2 44.93,7.47 JP9.12 | NRST.P$1 59.35,28 48,28 47.6,28.4 v45.6,28.4
PA0  (via drill 0.4)
  Top 0.203: IC1.10 38.59,21.99
  Top 0.254: 38.59,21.99 v38.4,21.8
  Bottom 0.254: v38.4,21.8 38.6,22 39.8,22 40.4,22.6 40.4,25.1 v40,25.5 39.5,25.5 39.2,25.8 39.2,27.4 38.2,28.4 38.2,29.2 38.4,29.4 47.6,29.4 48.4,28.6 51.2,28.6 52.4,29.8 52.8,29.8 53.6,30.6 58.2,30.6 60.2,32.6 60.2,34.7 JP1.23
PA1  (via drill 0.4)
  Top 0.203: IC1.11 41.09,22.49
  Top 0.254: 41.09,22.49 41.4,22.8 41.4,23.6 41,24 39.9,24 v39.4,24.3
  Bottom 0.254: v39.4,24.3 39.1,24.3 38.6,24.8 38.6,27 37.6,28 37.6,29.6 38,30 47.8,30 48.6,29.2 51,29.2 52.2,30.4 52.6,30.4 53.4,31.2 57.8,31.2 58.9,32.3 58.9,36 JP1.22
PA2  (via drill 0.4)
  Top 0.203: IC1.12 38.41,22.99
  Top 0.254: 38.41,22.99 v38.2,23.2
  Bottom 0.254: v38.2,23.2 38,23.4 38,26.8 37,27.8 37,30.2 37.4,30.6 48,30.6 48.8,29.8 50.8,29.8 52,31 52.4,31 53.2,31.8 57.4,31.8 58,32.4 58,33 57.63,33.37 JP1.21
PA3
  Top 0.203: IC1.13 38.56,26.16
  Top 0.254: 38.56,26.16 38.8,26.4 39.6,26.4 43.2,30 53.4,30 54.6,31.2 54.6,31.7 56.4,33.5 56.4,35.96 JP1.20
PA4
  Top 0.203: IC1.14 38.06,26.66
  Top 0.254: 38.06,26.66 38.4,27 39.4,27 43,30.6 53.2,30.6 54,31.4 54,32.2 55.09,33.29 JP1.19
PA5
  Top 0.203: IC1.15 37.56,27.16
  Top 0.254: 37.56,27.16 38,27.6 39.2,27.6 42.8,31.2 53,31.2 53.4,31.6 53.4,33.1 53.8,33.5 53.8,36.02 JP1.18
PA6  (via drill 0.4)
  Top 0.203: IC1.16 37.06,22.86
  Top 0.254: 37.06,22.86 v37,22.8 | v52.2,32.1 52.55,32.45 JP1.17
  Bottom 0.254: v37,22.8 37,25.2 37.5,25.7 37.5,26.5 37,27 36.6,27 36.4,27.2 36.4,30.6 37,31.2 48.2,31.2 49,30.4 50.5,30.4 v52.2,32.1
PA7  (via drill 0.4)
  Top 0.203: IC1.17 v36.56,26.04
  Top 0.254: v50.8,32.1 51.3,32.6 51.3,35.98 JP1.16
  Bottom 0.254: v36.56,26.04 36.16,26.04 35.8,26.4 35.8,30.8 36.8,31.8 48.4,31.8 49.2,31 49.7,31 v50.8,32.1
PA8
  Top 0.2: IC1.29 31.3,21 29,21 27.2,22.8 27.2,27.8 31.8,32.4 36.4,32.4 37.31,33.31 JP1.5
PA9
  Top 0.2: IC1.30 28.71,20.49 26.6,22.6 26.6,28 31.6,33 35.2,33 36,33.8 36,36.04 JP1.4
PA10  (via drill 0.35, 0.4)
  Top 0.2: v25.2,28.4 26.2,28.4 30.8,33 30.8,35.6 31.2,36 33.5,36 JP1.3
  Top 0.203: IC1.31 27.81,19.99 26.2,21.6 v25.6,21.6
  Top 0.254: v21.8,20.8 21.8,22.05 R22.1
  Bottom 0.254: v21.8,20.8 22.6,21.6 v25.6,21.6 25.6,28 v25.2,28.4
PA11
  Top 0.203: IC1.32 29.79,19.49 29.7,19.4
  Top 0.406: 29.7,19.4 25.8,19.4 arc-45 25.46,19.54 23.6,21.4 arc-45 23.4,21.88 23.4,24.46 arc45 23.3,24.7 21.5,26.5 arc45 21.11,26.66 18.9,26.66 arc-45 18.54,26.81 18.16,27.19 arc45 17.76,27.35 16.19,27.35 U1.D2
PA12
  Top 0.203: IC1.33 30.4,18.99 30.1,18.69
  Top 0.406: U1.D1 16.19,25.45 17.9,25.45 arc45 18.06,25.51 18.33,25.78 arc-45 18.74,25.95 20.71,25.95 arc-45 21.28,25.72 22.55,24.45 | 30.1,18.69 25.59,18.69 arc-45 25.11,18.9 22.85,21.15 arc-45 22.69,21.53 22.69,24.11 arc45 22.55,24.45 | 22.55,24.45 | 22.55,24.45 22.6,24.4
PB0  (via drill 0.4)
  Top 0.203: IC1.18 36.06,23.06
  Top 0.254: 36.06,23.06 v35.8,22.8 | v49.4,32.1 50.01,32.71 JP1.15
  Bottom 0.254: v35.8,22.8 35.8,23.4 35.2,24 35.2,31.2 36.4,32.4 49,32.4 v49.4,32.1
PB1
  Top 0.203: IC1.19 35.56,27.96
  Top 0.254: 35.56,27.96 35.8,28.2 39,28.2 42.6,31.8 45.6,31.8 46.8,33 48.4,33 48.7,33.3 48.7,36.04 JP1.14
PB2  (via drill 0.4 pad 0.25)
  Top 0.254: R11.1 60.31,21 v60.4,21
  Bottom 0.254: v60.4,21 63.2,21 64.8,22.6 BOOT1.2
PB5
  Top 0.203: IC1.41 35.06,9.74
  Top 0.254: 35.06,9.74 35.8,9 37.2,9 38.6,7.6 45.2,7.6 46.2,6.6 46.2,4.6 46.8,4 53.82,4 JP9.20
PB6  (via drill 0.4)
  Top 0.203: IC1.42 35.56,10.24
  Top 0.254: 35.56,10.24 36.2,9.6 37.6,9.6 39,8.2 46,8.2 v46.6,7.6
  Bottom 0.254: v46.6,7.6 46.2,7.2 46.2,2 46.8,1.4 56.3,1.4 JP9.21
PB7  (via drill 0.4 pad 0.25)
  Top 0.203: IC1.43 36.06,10.74
  Top 0.254: 36.06,10.74 36.6,10.2 38,10.2 39.4,8.8 47,8.8 47.8,8 v48.2,8
  Bottom 0.254: v48.2,8 49,7.2 57.2,7.2 57.63,6.77 JP9.22
PB8
  Top 0.203: IC1.45 37.06,11.74
  Top 0.254: 37.06,11.74 37.4,11.4 38.8,11.4 40.2,10 47,10 47.4,10.4 48.2,10.4 48.8,9.8 48.8,8.8 50.4,7.2 58.4,7.2 58.9,6.7 58.9,4 JP9.23
PB9  (via drill 0.4)
  Top 0.203: IC1.46 37.56,12.44
  Top 0.254: 37.56,12.44 38,12 39.2,12 40.6,10.6 46.6,10.6 47,11 48.6,11 49.4,10.2 49.4,9.4 49.6,9.2 52.81,9.2 R9.2 | R9.2 52.8,9.11 | v51.1,8.2 52.1,8.2 52.5,8.6 52.5,8.81 R9.2
  Bottom 0.254: v51.1,8.2 58.9,8.2 60.17,6.93 JP9.24
PB10
  Top 0.2: IC1.21 34.56,28.56 34.8,28.8
  Top 0.254: 34.8,28.8 38.8,28.8 42.4,32.4 45.14,32.4 JP1.13
PB11
  Top 0.2: IC1.22 34.06,28.86 34.6,29.4
  Top 0.254: 34.6,29.4 38.6,29.4 42.2,33 42.9,33 43.7,33.8 43.7,35.96 JP1.10
PB12
  Top 0.2: IC1.25 30.21,22.99 29.6,23.6 29.6,27 32.6,30 33,30
  Top 0.254: 33,30 38.4,30 42.39,33.99 JP1.9
PB13
  Top 0.2: IC1.26 29.91,22.49 29,23.4 29,27.2 32.4,30.6 33,30.6
  Top 0.254: 33,30.6 38,30.6 41.1,33.7 41.1,36.02 JP1.8
PB14
  Top 0.2: IC1.27 31.3,22 29.6,22 28.4,23.2 28.4,27.4 32.2,31.2 33,31.2
  Top 0.254: 33,31.2 37.2,31.2 39.85,33.85 JP1.7
PB15
  Top 0.2: IC1.28 29.31,21.49 27.8,23 27.8,27.6 32,31.8 33,31.8
  Top 0.254: 33,31.8 36.8,31.8 38.6,33.6 38.6,35.98 JP1.6
PC13  (via drill 0.35, 0.4)
  Top 0.203: IC1.2 39.21,17.99
  Top 0.254: 39.21,17.99 38.6,18.6 v37.8,18.6 | v57,10.8 57,12.35 R4.1
  Bottom 0.254: v37.8,18.6 41.6,18.6 42,18.2 45.8,18.2 47.2,16.8 55.4,16.8 57,15.2 v57,10.8
V+  (via drill 0.4)
  Top 0.305: USB1.VBUS 8.27,27.6 9.8,27.6 10.6,28.4 v10.6,28.8
  Top 0.406: 3.65,18.35 D1.A
  Top 0.813: v5,17 5,17.6 4.2,18.4 3.85,18.4 D1.A
  Bottom 0.406: v10.6,28.8 10.2,28.4 10.2,20.4 6.8,17 v5,17
VCC_EXT
  Top 1.016: D2.A 9.8,2.85 9.8,3.8 10.8,4.8 12.6,4.8 13.8,6 13.8,11.8 J1.3
VCC_OUT  (via drill 0.4)
  Top 0.813: IC3.TAB IC3.2 26.8,10.6 23.6,13.8 22.95,13.8 C9.+ 22.6,14.15 v22.6,17.6
  Bottom 0.813: v22.6,17.6 22.6,16 C8.2 22.6,15.9 22.6,10.4 21.8,9.6 17,9.6 JP6.3
VDDA  (via drill 0.4)
  Top 0.203: IC1.9 41.69,21.49
  Top 0.254: 41.69,21.49 42.2,22 v42.2,23
  Bottom 0.254: v42.2,23 41.7,23.5 C7.1 42.77,25.55 L2.1
VUSB_OUT
  Bottom 0.406: L1.2 15.86,14.74 JP6.1

### Text on the board
tPlace: 2. | 1. | 5V | GND | NC | PA9 | PA8 | 5V | GND | PB1 | PB0 | PA7 | PA6 | PA5 | PA4 | PA3 | PA2 | PA1 | PA0 | NC | 1. | PB15 | PB14 | PB13 | PB12 | PB11 | PB10 | IRQ TEAM | v.1.006 rev. C | JTMS | JTCK | JTDO | JTDI | NRST | NRST | 3.3 | GND | GND | GND | NC | JNRST
bPlace: PB7 | 3.3 | NC | PB5 | PB9 | GND | NC | NC | PB6 | PB8